# Altium schematic sheet BLOCK DIAGRAM.SchDoc: Block Diagram
size 431 x 279 mm; CheckedBy: Lance Bantoto; Engineer: Cindy Li, Chealsie Bains; DocumentNumber: 1; Revision: 1; SheetNumber: 1; SheetTotal: 23
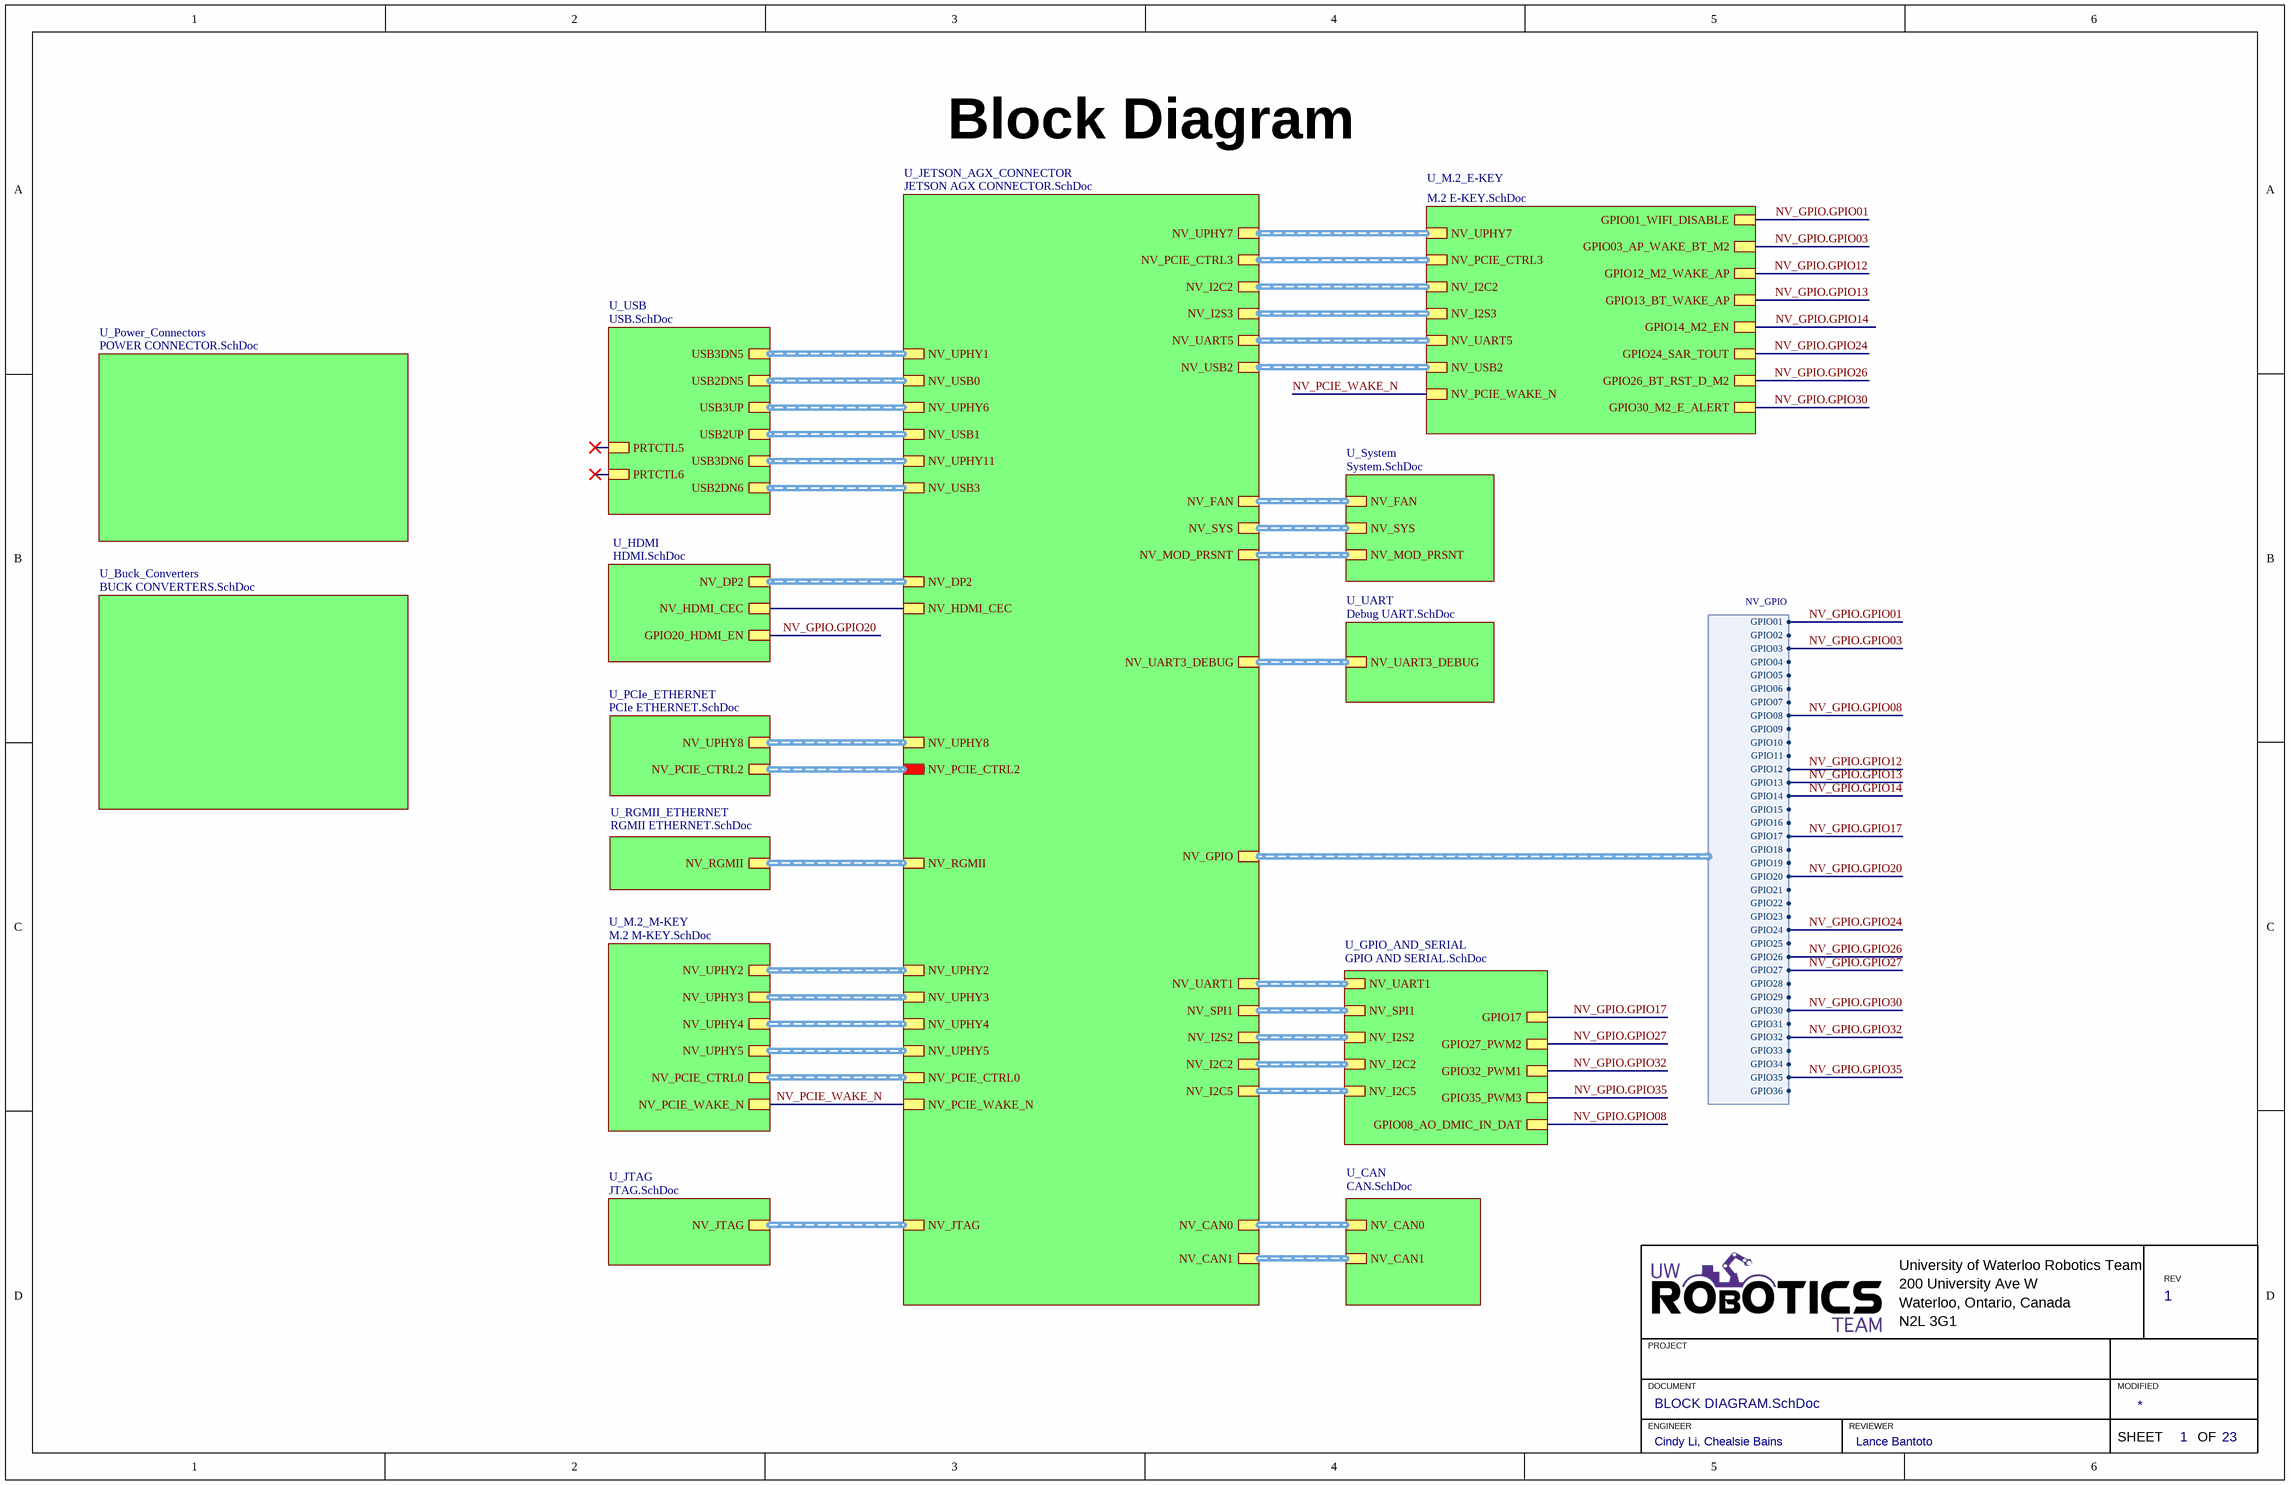
[diagram p0: BLOCK DIAGRAM.SchDoc]

## Sub-sheets
U_Buck_Converters = BUCK CONVERTERS.SchDoc: no entries
U_CAN = CAN.SchDoc: NV_CAN0 (harness CAN), NV_CAN1 (harness CAN)
U_GPIO_AND_SERIAL = GPIO AND SERIAL.SchDoc: NV_UART1 (harness UART_5-W), NV_SPI1 (harness UART_5-W), NV_I2S2 (harness UART_5-W), GPIO17, GPIO27_PWM2, GPIO32_PWM1, GPIO35_PWM3, GPIO08_AO_DMIC_IN_DAT, NV_I2C2 (harness UART_5-W), NV_I2C5 (harness UART_5-W)
U_HDMI = HDMI.SchDoc: NV_DP2 (harness DISPLAYPORT), NV_HDMI_CEC, GPIO20_HDMI_EN
U_JETSON_AGX_CONNECTOR = JETSON AGX CONNECTOR.SchDoc: NV_UPHY7 (harness UPHY), NV_PCIE_CTRL3 (harness PCIE_CTRL), NV_I2C2 (harness I2C), NV_I2S3 (harness I2S), NV_UART5 (harness UART_5-W), NV_USB2 (harness USB2), NV_GPIO (harness NV_GPIO), NV_DP2 (harness DISPLAYPORT), NV_HDMI_CEC, NV_CAN0 (harness CAN), NV_CAN1 (harness CAN), NV_USB0 (harness USB2), NV_USB1 (harness USB2), NV_USB3 (harness USB2), NV_UPHY1 (harness UPHY), NV_UPHY6 (harness UPHY), NV_UPHY11 (harness UPHY), NV_JTAG (harness NV_JTAG), NV_UART1 (harness UART_5-W), NV_SPI1 (harness UART_5-W), NV_I2S2 (harness UART_5-W), NV_UPHY8 (harness UPHY), NV_PCIE_CTRL2 (harness PCIE_CTRL), NV_RGMII (harness RGMII), NV_UPHY2 (harness UPHY), NV_UPHY3 (harness UPHY), NV_UPHY4 (harness UPHY), NV_UPHY5 (harness UPHY), NV_PCIE_CTRL0 (harness PCIE CTRL), NV_PCIE_WAKE_N, NV_UART3_DEBUG (harness UART_5-W), NV_I2C2 (harness UART_5-W), NV_I2C5 (harness UART_5-W), NV_FAN, NV_SYS, NV_MOD_PRSNT
U_JTAG = JTAG.SchDoc: NV_JTAG (harness NV_JTAG)
U_M.2_E-KEY = M.2 E-KEY.SchDoc: NV_UPHY7 (harness UPHY), NV_PCIE_CTRL3 (harness PCIE_CTRL), NV_I2C2 (harness I2C), NV_I2S3 (harness I2S), NV_UART5 (harness UART_5-W), NV_USB2 (harness USB2), GPIO12_M2_WAKE_AP, GPIO01_WIFI_DISABLE, GPIO03_AP_WAKE_BT_M2, GPIO13_BT_WAKE_AP, GPIO14_M2_EN, GPIO24_SAR_TOUT, GPIO26_BT_RST_D_M2, GPIO30_M2_E_ALERT, NV_PCIE_WAKE_N
U_M.2_M-KEY = M.2 M-KEY.SchDoc: NV_UPHY2 (harness UPHY), NV_UPHY3 (harness UPHY), NV_UPHY4 (harness UPHY), NV_UPHY5 (harness UPHY), NV_PCIE_CTRL0 (harness PCIE CTRL), NV_PCIE_WAKE_N
U_PCIe_ETHERNET = PCIe ETHERNET.SchDoc: NV_UPHY8 (harness UPHY), NV_PCIE_CTRL2 (harness PCIE CTRL)
U_Power_Connectors = POWER CONNECTOR.SchDoc: no entries
U_RGMII_ETHERNET = RGMII ETHERNET.SchDoc: NV_RGMII (harness RGMII)
U_System = System.SchDoc: NV_FAN, NV_SYS, NV_MOD_PRSNT
U_UART = Debug UART.SchDoc: NV_UART3_DEBUG (harness UART_5-W)
U_USB = USB.SchDoc: USB2DN5 (harness USB2), USB2UP (harness USB2), USB2DN6 (harness USB2), USB3DN5 (harness UPHY), USB3UP (harness UPHY), USB3DN6 (harness UPHY), PRTCTL5, PRTCTL6

## Harnesses
NV_GPIO: GPIO01, GPIO02, GPIO03, GPIO04, GPIO05, GPIO06, GPIO07, GPIO08, GPIO09, GPIO10, GPIO11, GPIO12, GPIO13, GPIO14, GPIO15, GPIO16, GPIO17, GPIO18, GPIO19, GPIO20, GPIO21, GPIO22, GPIO23, GPIO24, GPIO25, GPIO26, GPIO27, GPIO28, GPIO29, GPIO30, GPIO31, GPIO32, GPIO33, GPIO34, GPIO35, GPIO36

## Nets
NV_GPIO.GPIO01: sheet U_M.2_E-KEY/GPIO01_WIFI_DISABLE, sheet U_JETSON_AGX_CONNECTOR/NV_GPIO.GPIO01
NV_GPIO.GPIO03: sheet U_M.2_E-KEY/GPIO03_AP_WAKE_BT_M2, sheet U_JETSON_AGX_CONNECTOR/NV_GPIO.GPIO03
NV_GPIO.GPIO08: sheet U_GPIO_AND_SERIAL/GPIO08_AO_DMIC_IN_DAT, sheet U_JETSON_AGX_CONNECTOR/NV_GPIO.GPIO08
NV_GPIO.GPIO12: sheet U_M.2_E-KEY/GPIO12_M2_WAKE_AP, sheet U_JETSON_AGX_CONNECTOR/NV_GPIO.GPIO12
NV_GPIO.GPIO13: sheet U_M.2_E-KEY/GPIO13_BT_WAKE_AP, sheet U_JETSON_AGX_CONNECTOR/NV_GPIO.GPIO13
NV_GPIO.GPIO14: sheet U_M.2_E-KEY/GPIO14_M2_EN, sheet U_JETSON_AGX_CONNECTOR/NV_GPIO.GPIO14
NV_GPIO.GPIO17: sheet U_GPIO_AND_SERIAL/GPIO17, sheet U_JETSON_AGX_CONNECTOR/NV_GPIO.GPIO17
NV_GPIO.GPIO20: sheet U_HDMI/GPIO20_HDMI_EN, sheet U_JETSON_AGX_CONNECTOR/NV_GPIO.GPIO20
NV_GPIO.GPIO24: sheet U_M.2_E-KEY/GPIO24_SAR_TOUT, sheet U_JETSON_AGX_CONNECTOR/NV_GPIO.GPIO24
NV_GPIO.GPIO26: sheet U_M.2_E-KEY/GPIO26_BT_RST_D_M2, sheet U_JETSON_AGX_CONNECTOR/NV_GPIO.GPIO26
NV_GPIO.GPIO27: sheet U_GPIO_AND_SERIAL/GPIO27_PWM2, sheet U_JETSON_AGX_CONNECTOR/NV_GPIO.GPIO27
NV_GPIO.GPIO30: sheet U_M.2_E-KEY/GPIO30_M2_E_ALERT, sheet U_JETSON_AGX_CONNECTOR/NV_GPIO.GPIO30
NV_GPIO.GPIO32: sheet U_GPIO_AND_SERIAL/GPIO32_PWM1, sheet U_JETSON_AGX_CONNECTOR/NV_GPIO.GPIO32
NV_GPIO.GPIO35: sheet U_GPIO_AND_SERIAL/GPIO35_PWM3, sheet U_JETSON_AGX_CONNECTOR/NV_GPIO.GPIO35
NV_PCIE_WAKE_N: sheet U_M.2_E-KEY/NV_PCIE_WAKE_N, sheet U_M.2_M-KEY/NV_PCIE_WAKE_N, sheet U_JETSON_AGX_CONNECTOR/NV_PCIE_WAKE_N
(unnamed): sheet U_HDMI/NV_HDMI_CEC, sheet U_JETSON_AGX_CONNECTOR/NV_HDMI_CEC

## Buses and harness runs
harness sheet U_CAN/NV_CAN0 = sheet U_JETSON_AGX_CONNECTOR/NV_CAN0
harness sheet U_CAN/NV_CAN1 = sheet U_JETSON_AGX_CONNECTOR/NV_CAN1
harness sheet U_GPIO_AND_SERIAL/NV_I2C2 = sheet U_JETSON_AGX_CONNECTOR/NV_I2C2
harness sheet U_GPIO_AND_SERIAL/NV_I2C5 = sheet U_JETSON_AGX_CONNECTOR/NV_I2C5
harness sheet U_GPIO_AND_SERIAL/NV_I2S2 = sheet U_JETSON_AGX_CONNECTOR/NV_I2S2
harness sheet U_GPIO_AND_SERIAL/NV_SPI1 = sheet U_JETSON_AGX_CONNECTOR/NV_SPI1
harness sheet U_GPIO_AND_SERIAL/NV_UART1 = sheet U_JETSON_AGX_CONNECTOR/NV_UART1
harness sheet U_HDMI/NV_DP2 = sheet U_JETSON_AGX_CONNECTOR/NV_DP2
harness sheet U_JETSON_AGX_CONNECTOR/NV_FAN = sheet U_System/NV_FAN
harness sheet U_JETSON_AGX_CONNECTOR/NV_I2C2 = sheet U_M.2_E-KEY/NV_I2C2
harness sheet U_JETSON_AGX_CONNECTOR/NV_I2S3 = sheet U_M.2_E-KEY/NV_I2S3
harness sheet U_JETSON_AGX_CONNECTOR/NV_JTAG = sheet U_JTAG/NV_JTAG
harness sheet U_JETSON_AGX_CONNECTOR/NV_MOD_PRSNT = sheet U_System/NV_MOD_PRSNT
harness sheet U_JETSON_AGX_CONNECTOR/NV_PCIE_CTRL0 = sheet U_M.2_M-KEY/NV_PCIE_CTRL0
harness sheet U_JETSON_AGX_CONNECTOR/NV_PCIE_CTRL2 = sheet U_PCIe_ETHERNET/NV_PCIE_CTRL2
harness sheet U_JETSON_AGX_CONNECTOR/NV_PCIE_CTRL3 = sheet U_M.2_E-KEY/NV_PCIE_CTRL3
harness sheet U_JETSON_AGX_CONNECTOR/NV_RGMII = sheet U_RGMII_ETHERNET/NV_RGMII
harness sheet U_JETSON_AGX_CONNECTOR/NV_SYS = sheet U_System/NV_SYS
harness sheet U_JETSON_AGX_CONNECTOR/NV_UART3_DEBUG = sheet U_UART/NV_UART3_DEBUG
harness sheet U_JETSON_AGX_CONNECTOR/NV_UART5 = sheet U_M.2_E-KEY/NV_UART5
harness sheet U_JETSON_AGX_CONNECTOR/NV_UPHY1 = sheet U_USB/USB3DN5
harness sheet U_JETSON_AGX_CONNECTOR/NV_UPHY2 = sheet U_M.2_M-KEY/NV_UPHY2
harness sheet U_JETSON_AGX_CONNECTOR/NV_UPHY3 = sheet U_M.2_M-KEY/NV_UPHY3
harness sheet U_JETSON_AGX_CONNECTOR/NV_UPHY4 = sheet U_M.2_M-KEY/NV_UPHY4
harness sheet U_JETSON_AGX_CONNECTOR/NV_UPHY5 = sheet U_M.2_M-KEY/NV_UPHY5
harness sheet U_JETSON_AGX_CONNECTOR/NV_UPHY6 = sheet U_USB/USB3UP
harness sheet U_JETSON_AGX_CONNECTOR/NV_UPHY7 = sheet U_M.2_E-KEY/NV_UPHY7
harness sheet U_JETSON_AGX_CONNECTOR/NV_UPHY8 = sheet U_PCIe_ETHERNET/NV_UPHY8
harness sheet U_JETSON_AGX_CONNECTOR/NV_UPHY11 = sheet U_USB/USB3DN6
harness sheet U_JETSON_AGX_CONNECTOR/NV_USB0 = sheet U_USB/USB2DN5
harness sheet U_JETSON_AGX_CONNECTOR/NV_USB1 = sheet U_USB/USB2UP
harness sheet U_JETSON_AGX_CONNECTOR/NV_USB2 = sheet U_M.2_E-KEY/NV_USB2
harness sheet U_JETSON_AGX_CONNECTOR/NV_USB3 = sheet U_USB/USB2DN6

## Notes on the sheet
- University of Waterloo Robotics Team
- 200 University Ave W
- REV
- PROJECT
- Waterloo, Ontario, Canada
- N2L 3G1
- DOCUMENT
- ENGINEER
- REVIEWER
- MODIFIED
- SHEET
- OF